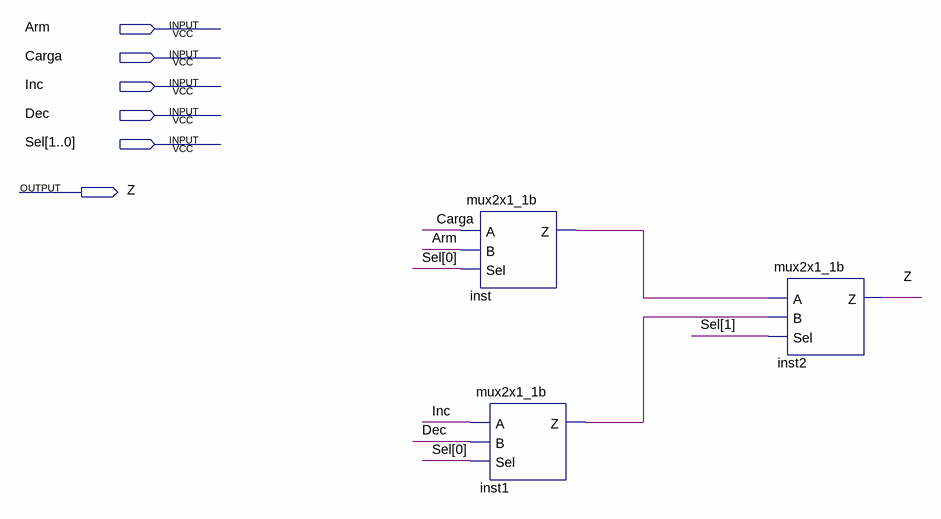
[diagram p0: schematic sheet]
// Quartus schematic mux4x1_1b.bdf as structural Verilog: 3 symbols, 6 pins
module mux4x1_1b (
  input  Arm,
  input  Carga,
  input  Inc,
  input  Dec,
  input  [1:0] Sel,
  output Z
);

  wire inst1_z, inst_z;

  mux2x1_1b inst (.A(Carga), .B(Arm), .Sel(Sel[0]), .Z(inst_z));
  mux2x1_1b inst1 (.A(Inc), .B(Dec), .Sel(Sel[0]), .Z(inst1_z));
  mux2x1_1b inst2 (.A(inst_z), .B(inst1_z), .Sel(Sel[1]), .Z(Z));
endmodule
